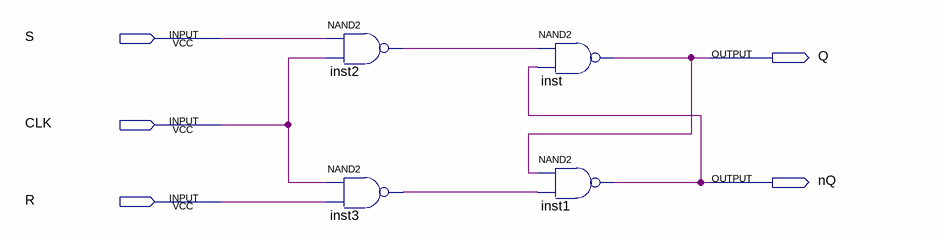
[diagram p0: schematic sheet]
// Quartus schematic srflipflop.bdf as structural Verilog: 4 symbols, 5 pins
module srflipflop (
  input  S,
  input  CLK,
  input  R,
  output Q,
  output nQ
);

  wire inst2_out, inst3_out;

  nand inst2 (inst2_out, S, CLK);
  nand inst3 (inst3_out, CLK, R);
  nand inst (Q, inst2_out, nQ);
  nand inst1 (nQ, Q, inst3_out);
endmodule
